# Altium schematic sheet Controller.SchDoc
size A4
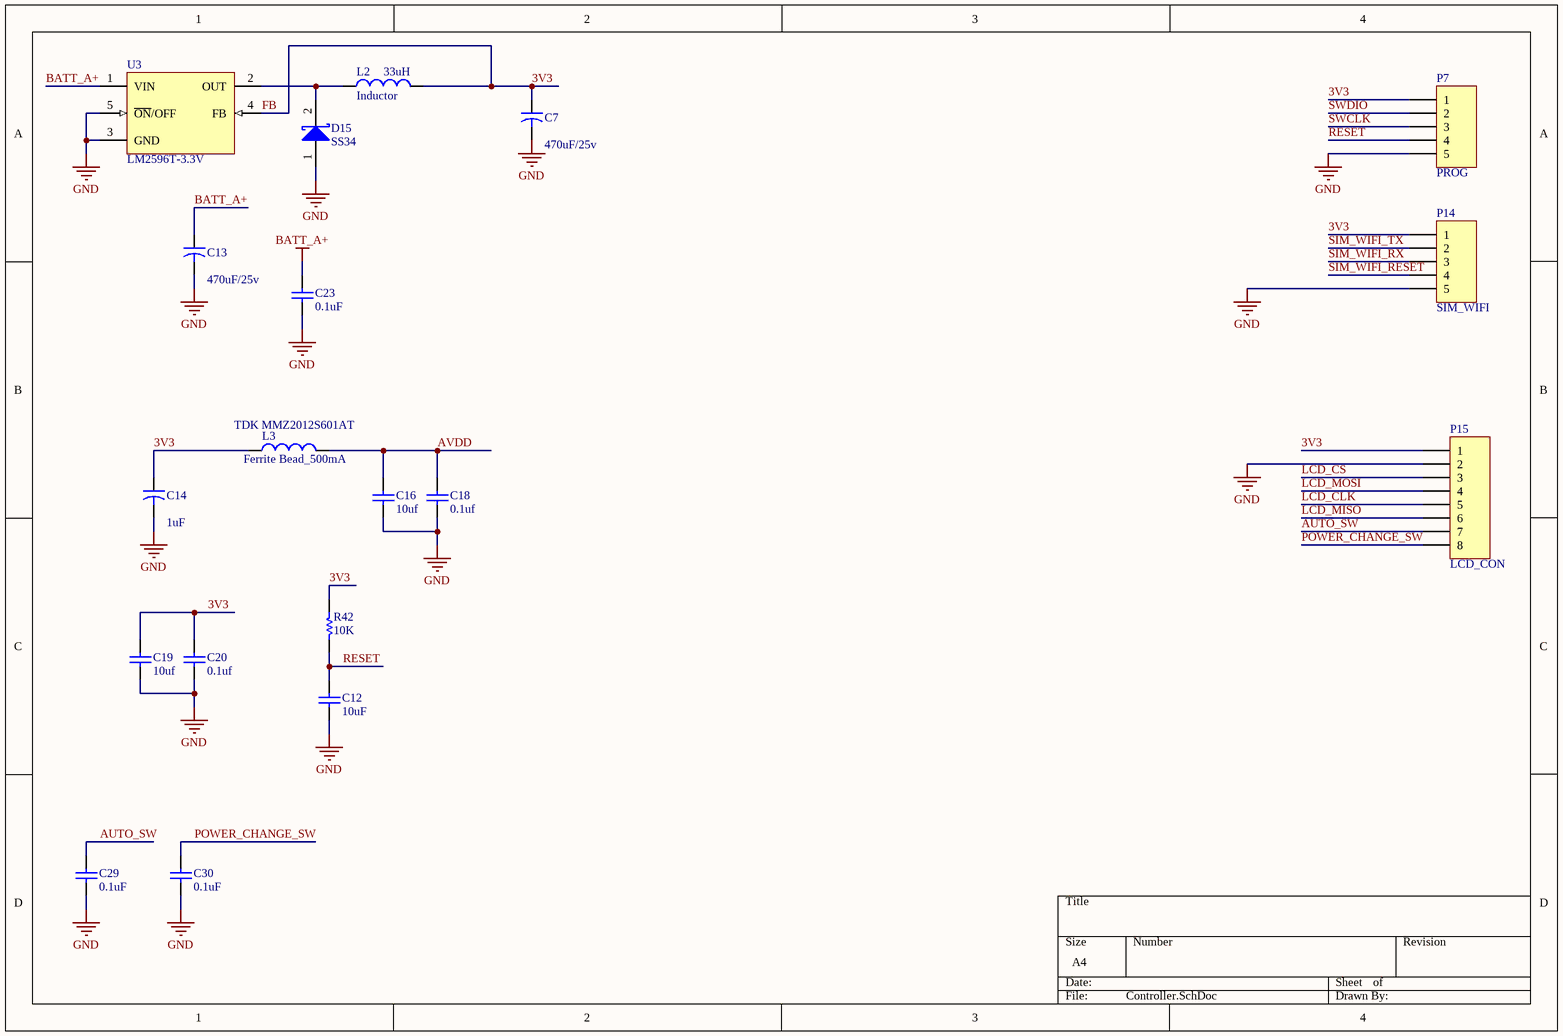
[diagram p0: Controller.SchDoc]

## Parts
C7  value 470uF/25v  [Cap_470uf_10X10.2mm]  (hidden comment: Cap2)
C12  value 10uF  [0805]  (hidden comment: Cap)
C13  value 470uF/25v  [Cap_470uf_10X10.2mm]  (hidden comment: Cap2)
C14  value 1uF  [0805]  (hidden comment: Cap2)
C16  value 10uf  [0805]  (hidden comment: Cap)
C18  value 0.1uf  [0805]  (hidden comment: Cap)
C19  value 10uf  [0805]  (hidden comment: Cap)
C20  value 0.1uf  [0805]  (hidden comment: Cap)
C23  value 0.1uF  [0805]  (hidden comment: Cap)
C29  value 0.1uF  [0805]  (hidden comment: Cap)
C30  value 0.1uF  [0805]  (hidden comment: Cap)
D15  SS34  [SMA]
L2  Inductor  value 33uH  [Inductor_SMD_33uh]
L3  Ferrite Bead_500mA  value TDK MMZ2012S601AT  [0805]
P7  PROG  [HDR1X5]
P14  SIM_WIFI  [HDR1X5]
P15  LCD_CON  [HDR1X8]
R42  value 10K  [0805]  (hidden comment: Res1)
U3  LM2596T-3.3V  [LM2596S50TR]

## Nets
BATT_A+: C13.1 C23.1 U3.1(VIN)
GND: C7.2 C12.1 C13.2 C14.2 C16.1 C18.1 C19.1 C20.1 C23.2 C29.2 C30.2 D15.1(A) P7.5 P14.5 P15.2 U3.3(GND) U3.5(~{ON}/OFF)
3V3: C7.1 C14.1 C19.2 C20.2 L2.2 L3.1 P7.1 P14.1 P15.1 R42.1 U3.4(FB)  [also labelled FB]
AUTO_SW: C29.1 P15.7
AVDD: C16.2 C18.2 L3.2
LCD_CLK: P15.5
LCD_CS: P15.3
LCD_MISO: P15.6
LCD_MOSI: P15.4
POWER_CHANGE_SW: C30.1 P15.8
RESET: C12.2 P7.4 R42.2
SIM_WIFI_RESET: P14.4
SIM_WIFI_RX: P14.3
SIM_WIFI_TX: P14.2
SWCLK: P7.3
SWDIO: P7.2
NetD15_2: D15.2(K) L2.1 U3.2(OUT)

## Library data of the parts
C7 C13 C14 = Cap2: Capacitor; Published: 23-Sep-2002; PackageReference: CAPR5-4X5; Publisher: Altium Limited; PackageDescription: Capacitor; 2 Leads
C12 C16 C18-C20 C23 C29 C30 = Cap: Capacitor; Published: 8-Jun-2000; LatestRevisionDate: 17-Jul-2002; LatestRevisionNote: Re-released for DXP Platform.; PackageReference: RAD-0.3; Publisher: Altium Limited; PackageDescription: Radial Cap, Thru-Hole; 2 Leads; 0.3 in Pin Spacing
D15 = Diode 10TQ035: Schottky Rectifier; Note: Terminal 2 is the TAB and is electrically connected to the cathode; Published: 8-Jun-2000; LatestRevisionDate: 17-Jul-2002; LatestRevisionNote: Re-released for DXP Platform.; DatasheetVersion: PD-2.057B; PackageVersion: Feb-1998; PackageReference: TO-220AC; Publisher: Altium Limited; PackageDescription: TO, Thru-Hole, Vertical, Heatsink Mounted; 3 In-Line Leads (1 Absent); Pitch 2.54 mm; ComponentLink1Description: Manufacturer Link; ComponentLink1URL: http://www.irf.com/; ComponentLink2Description: Datasheet; ComponentLink2URL: http://www.irf.com/product-info/datasheets/data/10tq.pdf
L2 L3 = Inductor: Code_IEC: 1005; Published: 8-Jun-2000; LatestRevisionDate: 29-May-2009; LatestRevisionNote: IPC-7351 Footprint Added.; PackageReference: 0402-A; Publisher: Altium Limited; PackageDescription: Chip Inductor; Code_JEITA: 0402
P7 P14 = Header 5: Header, 5-Pin; LatestRevisionDate: 17-Jul-2002; LatestRevisionNote: Re-released for DXP Platform.; Publisher: Altium Limited
P15 = Header 8: Header, 8-Pin; LatestRevisionDate: 17-Jul-2002; LatestRevisionNote: Re-released for DXP Platform.; Publisher: Altium Limited
R42 = Res1: Resistor; Published: 8-Jun-2000; LatestRevisionDate: 17-Jul-2002; LatestRevisionNote: Re-released for DXP Platform.; PackageReference: AXIAL-0.3; Publisher: Altium Limited; PackageDescription: Axial Device, Thru-Hole; 2 Leads; 0.3 in Pin Spacing
U3 = LM2596T-ADJ: Manufacturer: National Semiconductor; PackageTopMarking: NSUZXYTTE#*LM2596T*-ADJ P+; PowerWise: N; High-Reliability: Y; DatasheetVersion: May-2002; PackageVersion: revA, Oct-1989; PackageReference: T05D; PackageDescription: TO-220, Molded, Stagger Bend, 5 Lead; PartNumber: LM2596T-3.3; RoHS: N; PinCount: 5; ComponentLink1URL: http://www.national.com/; ComponentLink2Description: LM2596 Datasheet; ComponentLink3URL: http://www.national.com/pf/LM/LM2596.html; ComponentLink4Description: T05D Package Page; ComponentLink4URL: http://www.national.com/packaging/folders/t05d.html